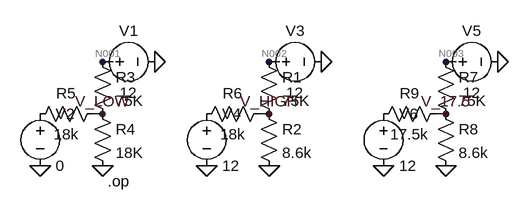
[diagram p0: schematic Voltage_Shifter.asc]
Voltage_Shifter.asc, the LTspice schematic file:
Version 4.1
SHEET 1 992 680
WIRE 192 112 176 112
WIRE 448 112 432 112
WIRE 720 112 704 112
WIRE 176 192 160 192
WIRE 432 192 416 192
WIRE 704 192 688 192
FLAG 176 272 0
FLAG 256 112 0
FLAG 176 192 V_LOW
FLAG 80 272 0
FLAG 432 272 0
FLAG 512 112 0
FLAG 432 192 V_HIGH
FLAG 336 272 0
FLAG 704 272 0
FLAG 784 112 0
FLAG 704 192 V_17.5
FLAG 608 272 0
SYMBOL res 160 96 R0
SYMATTR InstName R3
SYMATTR Value 75K
SYMBOL res 160 176 R0
SYMATTR InstName R4
SYMATTR Value 18K
SYMBOL res 176 176 R90
WINDOW 0 0 56 VBottom 2
WINDOW 3 32 56 VTop 2
SYMATTR InstName R5
SYMATTR Value 18k
SYMBOL voltage 160 112 R270
WINDOW 0 32 56 VTop 2
WINDOW 3 -32 56 VBottom 2
WINDOW 123 0 0 Left 0
WINDOW 39 0 0 Left 0
SYMATTR InstName V1
SYMATTR Value 12
SYMBOL voltage 80 176 R0
WINDOW 123 0 0 Left 0
WINDOW 39 0 0 Left 0
SYMATTR InstName V2
SYMATTR Value 0
SYMBOL res 416 96 R0
SYMATTR InstName R1
SYMATTR Value 75K
SYMBOL res 416 176 R0
SYMATTR InstName R2
SYMATTR Value 8.6k
SYMBOL res 432 176 R90
WINDOW 0 0 56 VBottom 2
WINDOW 3 32 56 VTop 2
SYMATTR InstName R6
SYMATTR Value 18k
SYMBOL voltage 416 112 R270
WINDOW 0 32 56 VTop 2
WINDOW 3 -32 56 VBottom 2
WINDOW 123 0 0 Left 0
WINDOW 39 0 0 Left 0
SYMATTR InstName V3
SYMATTR Value 12
SYMBOL voltage 336 176 R0
WINDOW 123 0 0 Left 0
WINDOW 39 0 0 Left 0
SYMATTR InstName V4
SYMATTR Value 12
SYMBOL res 688 96 R0
SYMATTR InstName R7
SYMATTR Value 75K
SYMBOL res 688 176 R0
SYMATTR InstName R8
SYMATTR Value 8.6k
SYMBOL res 704 176 R90
WINDOW 0 0 56 VBottom 2
WINDOW 3 32 56 VTop 2
SYMATTR InstName R9
SYMATTR Value 17.5k
SYMBOL voltage 688 112 R270
WINDOW 0 32 56 VTop 2
WINDOW 3 -32 56 VBottom 2
WINDOW 123 0 0 Left 0
WINDOW 39 0 0 Left 0
SYMATTR InstName V5
SYMATTR Value 12
SYMBOL voltage 608 176 R0
WINDOW 123 0 0 Left 0
WINDOW 39 0 0 Left 0
SYMATTR InstName V6
SYMATTR Value 12
TEXT 184 296 Left 2 !.op

The netlist it stands for:
* Voltage_Shifter.asc
R3 N001 V_LOW 75K
R4 V_LOW 0 18K
R5 V_LOW P001 18k
V1 N001 0 12
V2 P001 0 0
R1 N002 V_HIGH 75K
R2 V_HIGH 0 8.6k
R6 V_HIGH P002 18k
V3 N002 0 12
V4 P002 0 12
R7 N003 V_17.5 75K
R8 V_17.5 0 8.6k
R9 V_17.5 P003 17.5k
V5 N003 0 12
V6 P003 0 12
.op
.backanno
.end

* Results of the author's LTspice run, read from the files saved beside the schematic
* Operating Point:
*   V(v_low) = 1.286 V
*   V(n002) = 12 V
*   V(v_high) = 4.464 V
*   V(n003) = 12 V
*   V(n001) = 12 V
*   V(p001) = 0 V
*   V(p002) = 12 V
*   V(v_17.5) = 4.528 V
*   V(p003) = 12 V
*   I(R3) = 142.9 µA
*   I(R5) = 71.43 µA
*   I(R6) = -418.6 µA
*   I(R7) = 99.62 µA
*   I(R9) = -426.9 µA
*   I(V5) = -99.62 µA
*   I(V2) = 71.43 µA
*   I(R1) = 100.5 µA
*   I(R4) = 71.43 µA
*   I(V1) = -142.9 µA
*   I(R2) = 519.1 µA
*   I(R8) = 526.6 µA
*   I(V3) = -100.5 µA
*   I(V4) = -418.6 µA
*   I(V6) = -426.9 µA